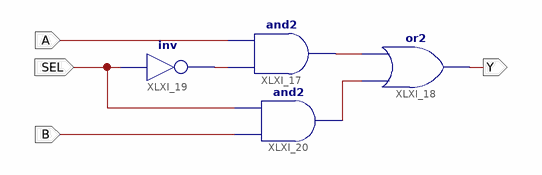
[diagram p0: schematic sheet 1]
// Xilinx ISE schematic mux_2.sch (zynq) as structural Verilog: 4 symbols, 4 ports
module mux_2 (
  input  B,
  input  A,
  input  SEL,
  output Y
);

  wire XLXN_7, XLXN_8, XLXN_79;

  or XLXI_18 (Y, XLXN_8, XLXN_7);
  and XLXI_17 (XLXN_7, XLXN_79, A);
  and XLXI_20 (XLXN_8, B, SEL);
  not XLXI_19 (XLXN_79, SEL);
endmodule
